# Altium schematic sheet MCU.SchDoc
size 420 x 297 mm; SheetNumber: 1; Scale: {Мш.}; PageSetup: Record=PageOptions|CenterHorizontal=False|CenterVertical=False|PrintScale=0.49|XCorrection=0.00|YCorrection=0.00|PrintKind=1|BorderSize=5000000|LeftOffset=0|BottomOffset=0|Orientation=1|PaperLength=1000|PaperWidth=1000|Scale=100|PaperSource=15|PrintQuality=600|MediaType=1|DitherType=10|PrintScaleMode=1|PaperKind=A4; ProcessInspection: {Т.контр.}; Mass: {М.}; NormInspection: {Н.контр.}; Letter1Column: {}; Letter2Column: {}; Letter3Column: {}; DocumentType: {Документ}
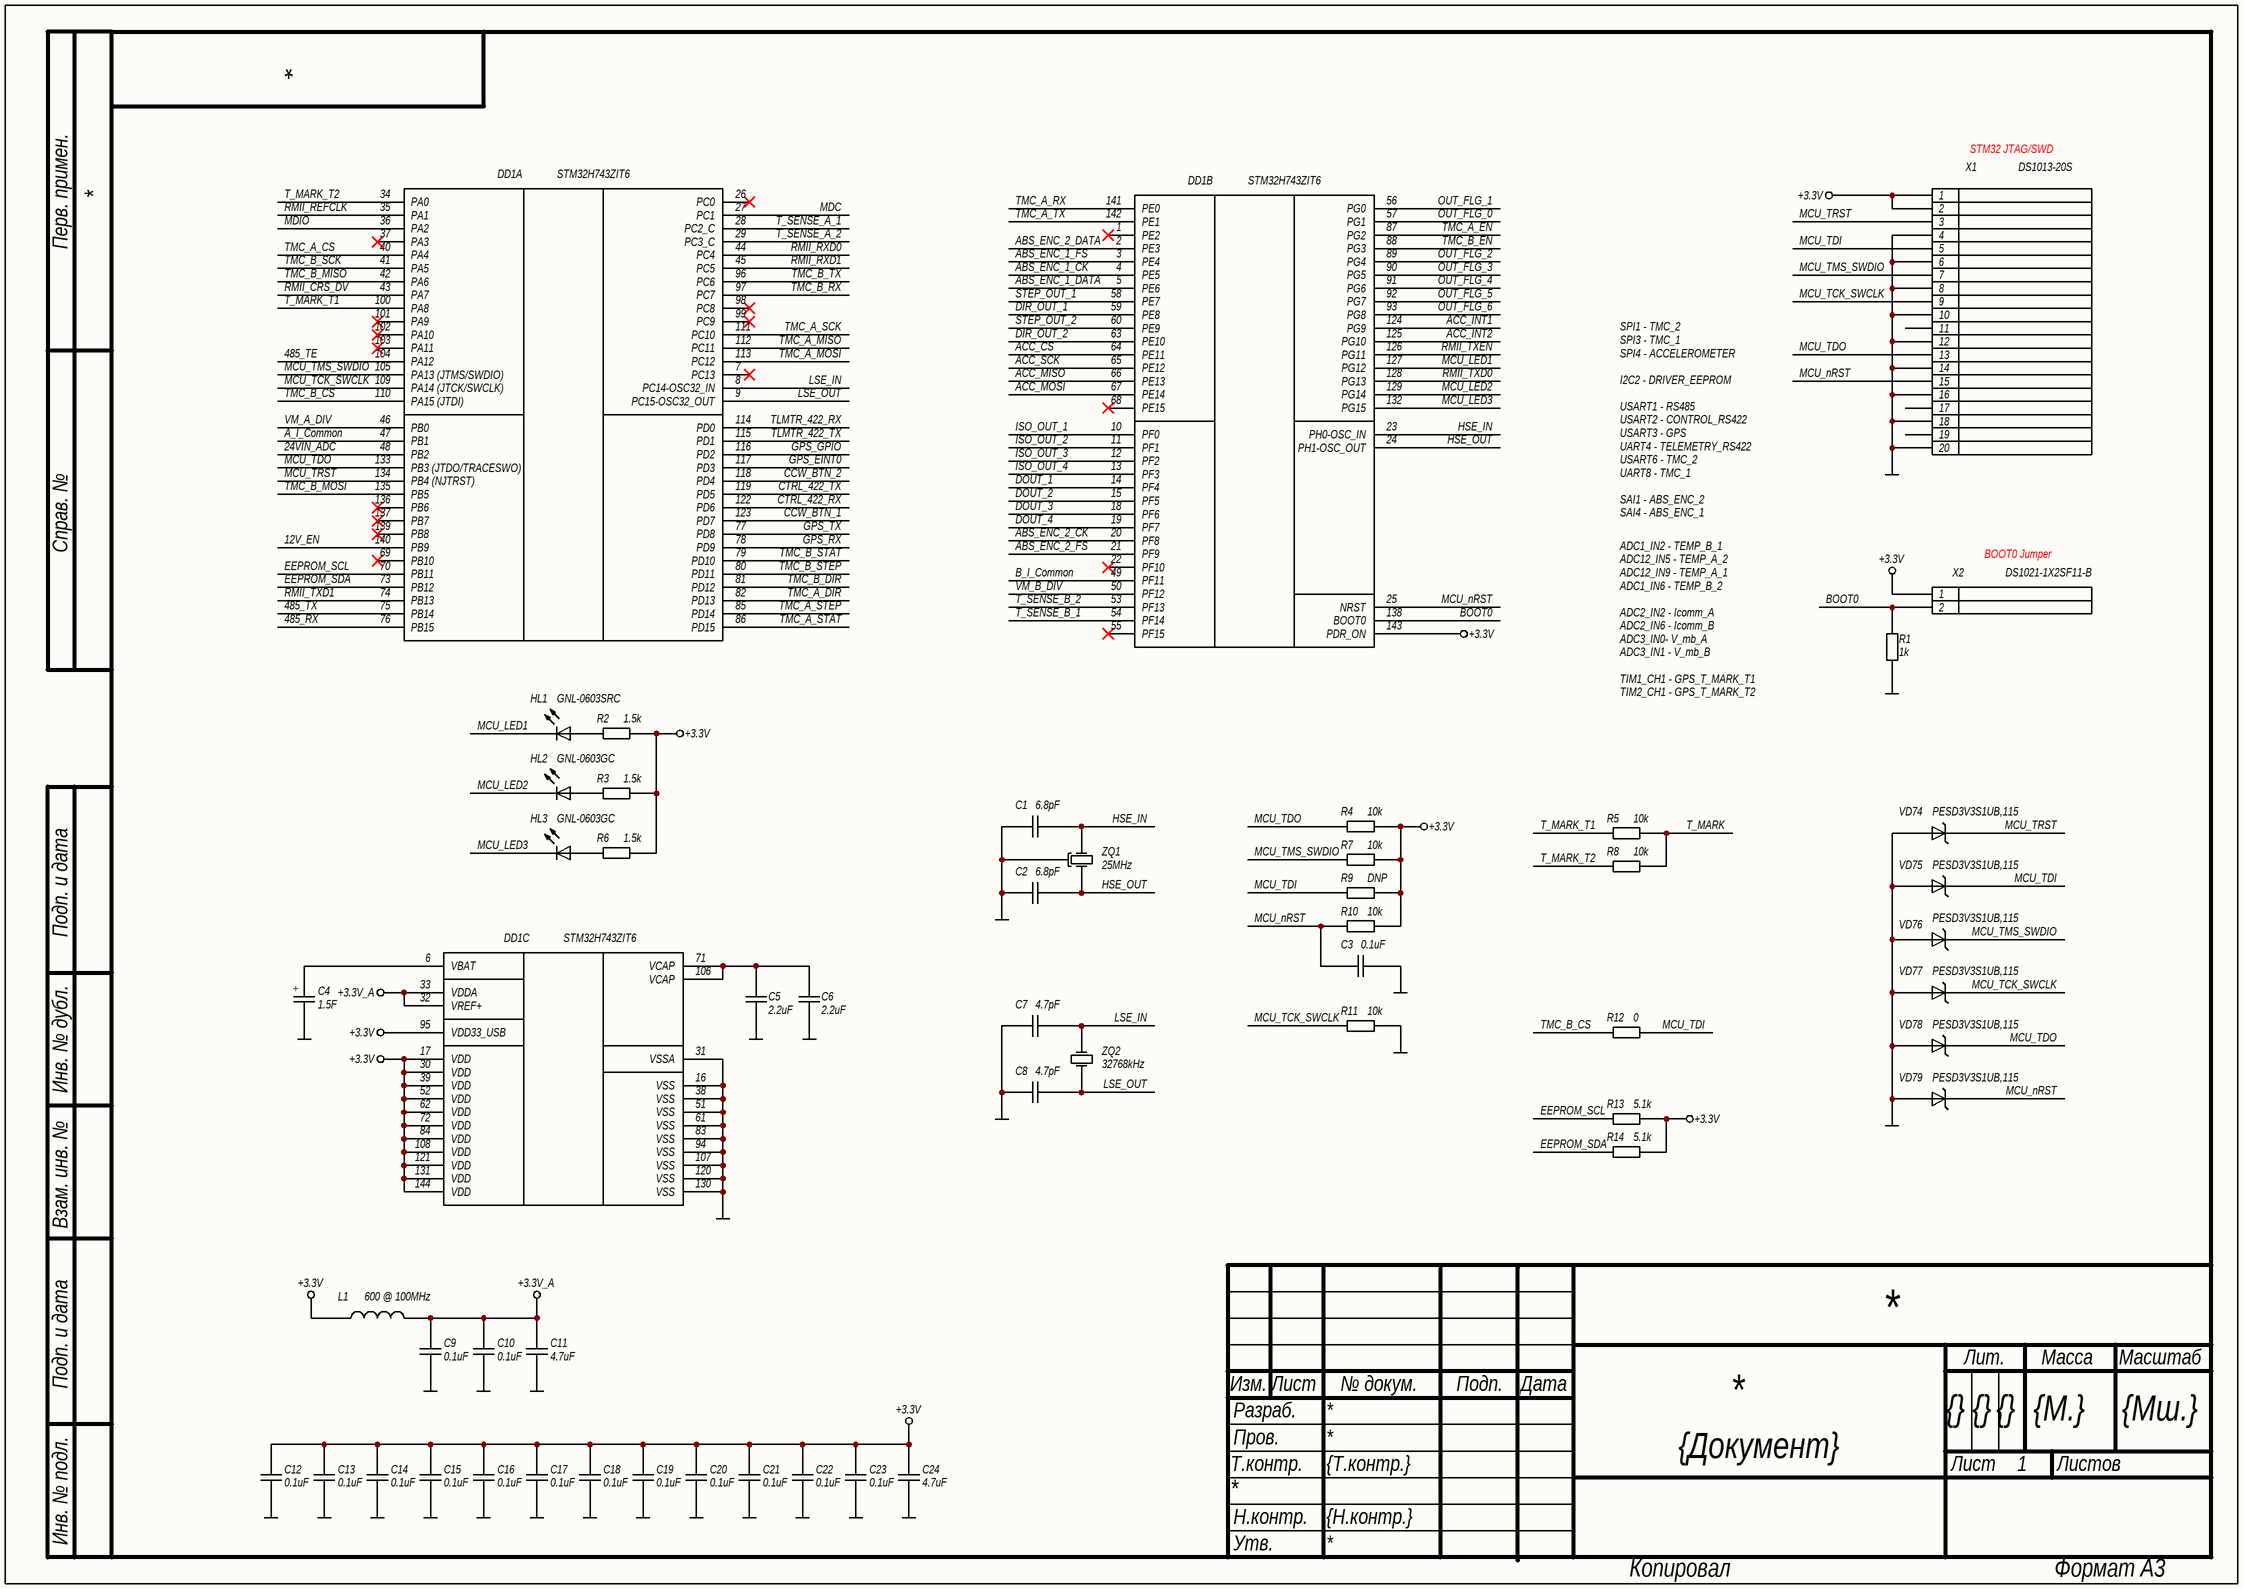
[diagram p0: MCU.SchDoc]

## Parts
C1  6.8pF  [C0603N]
C2  6.8pF  [C0603N]
C3  0.1uF  [C0603N]
C4  1.5F  [KR-5R5H155-R]
C5  2.2uF  [C0603N]
C6  2.2uF  [C0603N]
C7  4.7pF  [C0603N]
C8  4.7pF  [C0603N]
C9  0.1uF  [C0603N]
C10  0.1uF  [C0603N]
C11  4.7uF  [C0603N]
C12  0.1uF  [C0603N]
C13  0.1uF  [C0603N]
C14  0.1uF  [C0603N]
C15  0.1uF  [C0603N]
C16  0.1uF  [C0603N]
C17  0.1uF  [C0603N]
C18  0.1uF  [C0603N]
C19  0.1uF  [C0603N]
C20  0.1uF  [C0603N]
C21  0.1uF  [C0603N]
C22  0.1uF  [C0603N]
C23  0.1uF  [C0603N]
C24  4.7uF  [C0603N]
DD1  STM32H743ZIT6  [LQFP144]  (parts A,B,C of 3)
HL1  GNL-0603SRC  [LED0603]
HL2  GNL-0603GC  [LED0603]
HL3  GNL-0603GC  [LED0603]
L1  600 @ 100MHz  [FB0603N]
R1  1k  [R0603N]
R2  1.5k  [R0603N]
R3  1.5k  [R0603N]
R4  10k  [R0603N]
R5  10k  [R0603N]
R6  1.5k  [R0603N]
R7  10k  [R0603N]
R8  10k  [R0603N]
R9  DNP  [R0603N]  (no BOM)
R10  10k  [R0603N]
R11  10k  [R0603N]
R12  0  [R0603N]
R13  5.1k  [R0603N]
R14  5.1k  [R0603N]
VD74  PESD3V3S1UB,115  [SOD523]
VD75  PESD3V3S1UB,115  [SOD523]
VD76  PESD3V3S1UB,115  [SOD523]
VD77  PESD3V3S1UB,115  [SOD523]
VD78  PESD3V3S1UB,115  [SOD523]
VD79  PESD3V3S1UB,115  [SOD523]
X1  DS1013-20S  [2.54_2X10_HEADER_BOX]
X2  DS1021-1X2SF11-B  [2.54_2X1_HEADER]
ZQ1  25MHz  [NX3225GA]
ZQ2  32768kHz  [NX3215SA]

## Nets
+3.3V: C12.2 C13.2 C14.2 C15.2 C16.2 C17.2 C18.2 C19.2 C20.2 C21.2 C22.2 C23.2 C24.2 DD1.17(VDD) DD1.30(VDD) DD1.39(VDD) DD1.52(VDD) DD1.62(VDD) DD1.72(VDD) DD1.84(VDD) DD1.95(VDD33_USB) DD1.108(VDD) DD1.121(VDD) DD1.131(VDD) DD1.143(PDR_ON) DD1.144(VDD) L1.1 R2.1 R3.1 R4.1 R6.1 R7.1 R9.1 R10.1 R13.1 R14.1 X1.1 X1.2 X2.1
+3.3V_A: C9.2 C10.2 C11.2 DD1.32(VREF+) DD1.33(VDDA) L1.2
GND: C1.2 C2.2 C3.1 C4.2 C5.1 C6.1 C7.2 C8.2 C9.1 C10.1 C11.1 C12.1 C13.1 C14.1 C15.1 C16.1 C17.1 C18.1 C19.1 C20.1 C21.1 C22.1 C23.1 C24.1 DD1.16(VSS) DD1.31(VSSA) DD1.38(VSS) DD1.51(VSS) DD1.61(VSS) DD1.83(VSS) DD1.94(VSS) DD1.107(VSS) DD1.120(VSS) DD1.130(VSS) R1.2 R11.2 VD74.2(A) VD75.2(A) VD76.2(A) VD77.2(A) VD78.2(A) VD79.2(A) X1.4 X1.6 X1.8 X1.10 X1.12 X1.14 X1.16 X1.18 X1.20 ZQ1.2
12V_EN: DD1.140(PB9)
24VIN_ADC: DD1.48(PB2)
485_RX: DD1.76(PB15)
485_TE: DD1.104(PA12)
485_TX: DD1.75(PB14)
A_I_Common: DD1.47(PB1)
ABS_ENC_1_CK: DD1.4(PE5)
ABS_ENC_1_DATA: DD1.5(PE6)
ABS_ENC_1_FS: DD1.3(PE4)
ABS_ENC_2_CK: DD1.20(PF8)
ABS_ENC_2_DATA: DD1.2(PE3)
ABS_ENC_2_FS: DD1.21(PF9)
ACC_CS: DD1.64(PE11)
ACC_INT1: DD1.124(PG9)
ACC_INT2: DD1.125(PG10)
ACC_MISO: DD1.66(PE13)
ACC_MOSI: DD1.67(PE14)
ACC_SCK: DD1.65(PE12)
B_I_Common: DD1.49(PF11)
BOOT0: DD1.138(BOOT0) R1.1 X2.2
CCW_BTN_1: DD1.123(PD7)
CCW_BTN_2: DD1.118(PD4)
CTRL_422_RX: DD1.122(PD6)
CTRL_422_TX: DD1.119(PD5)
DIR_OUT_1: DD1.59(PE8)
DIR_OUT_2: DD1.63(PE10)
DOUT_1: DD1.14(PF4)
DOUT_2: DD1.15(PF5)
DOUT_3: DD1.18(PF6)
DOUT_4: DD1.19(PF7)
EEPROM_SCL: DD1.70(PB11) R13.2
EEPROM_SDA: DD1.73(PB12) R14.2
GPS_EINT0: DD1.117(PD3)
GPS_GPIO: DD1.116(PD2)
GPS_RX: DD1.78(PD9)
GPS_TX: DD1.77(PD8)
HSE_IN: C1.1 DD1.23(PH0-OSC_IN) ZQ1.1
HSE_OUT: C2.1 DD1.24(PH1-OSC_OUT) ZQ1.3
ISO_OUT_1: DD1.10(PF0)
ISO_OUT_2: DD1.11(PF1)
ISO_OUT_3: DD1.12(PF2)
ISO_OUT_4: DD1.13(PF3)
LSE_IN: C7.1 DD1.8(PC14-OSC32_IN) ZQ2.2
LSE_OUT: C8.1 DD1.9(PC15-OSC32_OUT) ZQ2.1
MCU_LED1: DD1.127(PG12) HL1.1(K)
MCU_LED2: DD1.129(PG14) HL2.1(K)
MCU_LED3: DD1.132(PG15) HL3.1(K)
MCU_nRST: C3.2 DD1.25(NRST) R10.2 VD79.1(K) X1.15
MCU_TCK_SWCLK: DD1.109(PA14_(JTCK/SWCLK)) R11.1 VD77.1(K) X1.9
MCU_TDI: R9.2 R12.1 VD75.1(K) X1.5
MCU_TDO: DD1.133(PB3_(JTDO/TRACESWO)) R4.2 VD78.1(K) X1.13
MCU_TMS_SWDIO: DD1.105(PA13_(JTMS/SWDIO)) R7.2 VD76.1(K) X1.7
MCU_TRST: DD1.134(PB4_(NJTRST)) VD74.1(K) X1.3
MDC: DD1.27(PC1)
MDIO: DD1.36(PA2)
OUT_FLG_0: DD1.57(PG1)
OUT_FLG_1: DD1.56(PG0)
OUT_FLG_2: DD1.89(PG4)
OUT_FLG_3: DD1.90(PG5)
OUT_FLG_4: DD1.91(PG6)
OUT_FLG_5: DD1.92(PG7)
OUT_FLG_6: DD1.93(PG8)
RMII_CRS_DV: DD1.43(PA7)
RMII_REFCLK: DD1.35(PA1)
RMII_RXD0: DD1.44(PC4)
RMII_RXD1: DD1.45(PC5)
RMII_TXD0: DD1.128(PG13)
RMII_TXD1: DD1.74(PB13)
RMII_TXEN: DD1.126(PG11)
STEP_OUT_1: DD1.58(PE7)
STEP_OUT_2: DD1.60(PE9)
T_MARK: R5.2 R8.2
T_MARK_T1: DD1.100(PA8) R5.1
T_MARK_T2: DD1.34(PA0) R8.1
T_SENSE_A_1: DD1.28(PC2_C)
T_SENSE_A_2: DD1.29(PC3_C)
T_SENSE_B_1: DD1.54(PF14)
T_SENSE_B_2: DD1.53(PF13)
TLMTR_422_RX: DD1.114(PD0)
TLMTR_422_TX: DD1.115(PD1)
TMC_A_CS: DD1.40(PA4)
TMC_A_DIR: DD1.82(PD13)
TMC_A_EN: DD1.87(PG2)
TMC_A_MISO: DD1.112(PC11)
TMC_A_MOSI: DD1.113(PC12)
TMC_A_RX: DD1.141(PE0)
TMC_A_SCK: DD1.111(PC10)
TMC_A_STAT: DD1.86(PD15)
TMC_A_STEP: DD1.85(PD14)
TMC_A_TX: DD1.142(PE1)
TMC_B_CS: DD1.110(PA15_(JTDI)) R12.2
TMC_B_DIR: DD1.81(PD12)
TMC_B_EN: DD1.88(PG3)
TMC_B_MISO: DD1.42(PA6)
TMC_B_MOSI: DD1.135(PB5)
TMC_B_RX: DD1.97(PC7)
TMC_B_SCK: DD1.41(PA5)
TMC_B_STAT: DD1.79(PD10)
TMC_B_STEP: DD1.80(PD11)
TMC_B_TX: DD1.96(PC6)
VM_A_DIV: DD1.46(PB0)
VM_B_DIV: DD1.50(PF12)
NetC4_1: C4.1 DD1.6(VBAT)
NetC5_2: C5.2 C6.2 DD1.71(VCAP) DD1.106(VCAP)
NetHL1_2: HL1.2(A) R2.2
NetHL2_2: HL2.2(A) R3.2
NetHL3_2: HL3.2(A) R6.2

Not connected (* = marked no-connect by the designer): DD1 1(PE2)* 7(PC13)* 22(PF10)* 26(PC0)* 37(PA3)* 55(PF15)* 68(PE15)* 69(PB10)* 98(PC8)* 99(PC9)* 101(PA9)* 102(PA10)* 103(PA11)* 136(PB6)* 137(PB7)* 139(PB8)*; X1 11 17 19

## Notes on the sheet
- STM32 JTAG/SWD
- SPI1 - TMC_2
- SPI3 - TMC_1
- I2C2 - DRIVER_EEPROM
- SPI4 - ACCELEROMETER
- USART2 - CONTROL_RS422
- USART6 - TMC_2
- USART1 - RS485
- USART3 - GPS
- UART4 - TELEMETRY_RS422
- UART8 - TMC_1
- SAI1 - ABS_ENC_2
- SAI4 - ABS_ENC_1
- ADC1_IN2 - TEMP_B_1
- ADC12_IN5 - TEMP_A_2
- ADC12_IN9 - TEMP_A_1
- ADC1_IN6 - TEMP_B_2
- BOOT0 Jumper
- ADC2_IN2 - Icomm_A
- ADC2_IN6 - Icomm_B
- ADC3_IN0- V_mb_A
- ADC3_IN1 - V_mb_B
- TIM1_CH1 - GPS_T_MARK_T1
- TIM2_CH1 - GPS_T_MARK_T2
- Перв. примен.
- Справ. №
- Подп. и дата
- Инв. № дубл.
- Взам. инв. №
- Изм.
- Лист
- № докум.
- Подп.
- Дата
- Лит.
- Масса
- Масштаб
- Т.контр.
- Пров.
- Разраб.
- Листов
- Инв. № подл.
- Н.контр.
- Утв.
- Копировал
- Формат А3
- (in symbol KR-5R5H155-R) +

## Library data of the parts
C1 C2 = CC0603CRNPO9BN6R8: Конденсатор; Точность: ±0.25pF; Напряжение: 50V; Диэлектрик: NP0; Производитель: YAGEO; Описание: 6.8 pF ±0.25pF 50V Ceramic Capacitor C0G, NP0 0603 (1608 Metric); Корпус: 0603 (1608 Metric); Температурный диапазон: -55°C ~ 125°C; Вид монтажа: SMD; Артикул: CC0603CRNPO9BN6R8; Номинал: 6.8pF; Строка для документации: https://www.yageo.com/upload/media/product/productsearch/datasheet/mlcc/UPY-GP_NP0_16V-to-50V_18.pdf; Тип элемента: Конденсатор
C3 C9 C10 C12-C23 = CL10B104KB8NNNC: Конденсатор; Точность: 10%; Напряжение: 50V; Диэлектрик: X7R; Производитель: Samsung Electro-Mechanics; Описание: 0.1 µF ±10% 50V Ceramic Capacitor X7R 0603 (1608 Metric); Корпус: 0603 (1608 Metric); Температурный диапазон: -55°C ~ 125°C; Вид монтажа: SMD; Артикул: CL10B104KB8NNNC; Номинал: 0.1uF; Строка для документации: https://mm.digikey.com/Volume0/opasdata/d220001/medias/docus/609/CL10B104KB8NNNC_Spec.pdf; Тип элемента: Конденсатор
C4 = KR-5R5H155-R: Ионистор; Точность: -20%, +80%; Напряжение: 5.5V; Диэлектрик: EDLC; Производитель: Eaton - Electronics Division; Описание: 1.5 F (EDLC) Supercapacitor 5.5 V Axial, Can - Horizontal 30Ohm @ 1kHz 1000 Hrs @ 70°C; Корпус: 19.00mm dia x 6.5mm; Температурный диапазон: -25°C ~ 70°C; Вид монтажа: Through Hole; Тип элемента: Конденсатор; Артикул: KR-5R5H155-R; Номинал: 1.5F; Строка для документации: https://www.eaton.com/content/dam/eaton/products/electronic-components/resources/data-sheet/eaton-kr-supercapacitors-coin-cells-data-sheet.pdf
C5 C6 = CL10A225KO8NNNC: Конденсатор; Точность: 10%; Напряжение: 16V; Диэлектрик: X5R; Производитель: Samsung Electro-Mechanics; Описание: 2.2 µF ±10% 16V Ceramic Capacitor X5R 0603 (1608 Metric); Корпус: 0603 (1608 Metric); Температурный диапазон: -55°C ~ 85°C; Вид монтажа: SMD; Артикул: CL10A225KO8NNNC; Номинал: 2.2uF; Строка для документации: https://mm.digikey.com/Volume0/opasdata/d220001/medias/docus/421/CL10A225KO8NNNC_Spec.pdf; Тип элемента: Конденсатор
C7 C8 = CC0603CRNPO9BN4R7: Конденсатор; Точность: ±0.25pF; Напряжение: 50V; Диэлектрик: NP0; Производитель: YAGEO; Описание: 4.7 pF ±0.25pF 50V Ceramic Capacitor C0G, NP0 0603 (1608 Metric); Корпус: 0603 (1608 Metric); Температурный диапазон: -55°C ~ 125°C; Вид монтажа: SMD; Артикул: CC0603CRNPO9BN4R7; Номинал: 4.7pF; Строка для документации: https://www.yageo.com/upload/media/product/productsearch/datasheet/mlcc/UPY-GP_NP0_16V-to-50V_18.pdf; Тип элемента: Конденсатор
C11 C24 = CL10A475KO8NNNC: Конденсатор; Точность: 10%; Напряжение: 16V; Диэлектрик: X5R; Производитель: Samsung Electro-Mechanics; Описание: 4.7 µF ±10% 16V Ceramic Capacitor X5R 0603 (1608 Metric); Корпус: 0603 (1608 Metric); Температурный диапазон: -55°C ~ 85°C; Вид монтажа: SMD; Артикул: CL10A475KO8NNNC; Номинал: 4.7uF; Строка для документации: https://mm.digikey.com/Volume0/opasdata/d220001/medias/docus/2328/CL10A475KO8NNNC_Spec.pdf; Тип элемента: Конденсатор
DD1 = STM32H743ZIT6: Микросхема микроконтроллер; Производитель: STMicroelectronics; Описание: ARM® Cortex®-M7 STM32H7 Microcontroller IC 32-Bit Single-Core 480MHz 2MB (2M x 8) FLASH 144-LQFP (20x20); Корпус: 144-LQFP (20x20); Температурный диапазон: -40°C ~ 85°C (TA); Вид монтажа: SMD; Артикул: STM32H743ZIT6; Строка для документации: https://www.st.com/resource/en/datasheet/stm32h743bi.pdf; Тип элемента: Микросхема
HL1 = GNL-0603SRC: Светодиод; Прямой ток: 20mA; Напряжение: 2V; Яркость: 15mcd; Цвет: Зеленый; Длина волны: 660nm; Производитель: G-nor Electronics; Описание: Green 567nm LED Indication - Discrete 2V 0603 (1608 Metric); Корпус: 0603 (1608 Metric); Температурный диапазон: -40°C ~ 80°C; Вид монтажа: SMD; Тип элемента: Диод светоизлучающий; Артикул: GNL-0603SRC; Строка для документации: https://www.g-nor.com/Uploads/Ed/file/20210517/1621223120713818.doc
HL2 HL3 = GNL-0603GC: Светодиод; Прямой ток: 20mA; Напряжение: 2V; Яркость: 12mcd; Цвет: Зеленый; Длина волны: 567nm; Производитель: G-nor Electronics; Описание: Green 567nm LED Indication - Discrete 2V 0603 (1608 Metric); Корпус: 0603 (1608 Metric); Температурный диапазон: -40°C ~ 80°C; Вид монтажа: SMD; Тип элемента: Диод светоизлучающий; Артикул: GNL-0603GC; Строка для документации: https://www.g-nor.com/Uploads/Ed/file/20210517/1621223120713818.doc
L1 = BLM18AG601SN1D: Фильтр ЭМП индуктивный; Ток: 500mA; Сопротивление: 380m; Тип: Ferrite Bead; Производитель: Murata Electronics; Описание: 600 Ohms @ 100 MHz 1 Ferrite Bead 0603 (1608 Metric) 500mA 380mOhm; Корпус: 0603 (1608 Metric); Температурный диапазон: -55°C ~ 125°C; Вид монтажа: SMD; Артикул: BLM18AG601SN1D; Номинал: 600 @ 100MHz; Строка для документации: https://www.murata.com/en-us/products/productdata/8796738650142/ENFA0003.pdf; Тип элемента: Фильтр ЭМП
R1 = RC0603FR-071KL: Резистор; Точность: 1%; ТКС: ±100ppm/°C; Напряжение: 75V; Производитель: YAGEO; Описание: 1 kOhms ±1% 0.1W, 1/10W Chip Resistor 0603 (1608 Metric) Moisture Resistant Thick Film; Корпус: 0603 (1608 Metric); Температурный диапазон: -55°C ~ 155°C; Вид монтажа: SMD; Артикул: RC0603FR-071KL; Номинал: 1k; Строка для документации: https://www.yageo.com/upload/media/product/app/datasheet/rchip/pyu-rc_group_51_rohs_l.pdf; Тип элемента: Резистор
R2 R3 R6 = RC0603FR-071K5L: Резистор; Точность: 1%; ТКС: ±100ppm/°C; Напряжение: 75V; Производитель: YAGEO; Описание: 1.5 kOhms ±1% 0.1W, 1/10W Chip Resistor 0603 (1608 Metric) Moisture Resistant Thick Film; Корпус: 0603 (1608 Metric); Температурный диапазон: -55°C ~ 155°C; Вид монтажа: SMD; Артикул: RC0603FR-071K5L; Номинал: 1.5k; Строка для документации: https://www.yageo.com/upload/media/product/app/datasheet/rchip/pyu-rc_group_51_rohs_l.pdf; Тип элемента: Резистор
R4 R5 R7-R11 = RC0603FR-0710KL: Резистор; Точность: 1%; ТКС: ±100ppm/°C; Напряжение: 75V; Производитель: YAGEO; Описание: 10 kOhms ±1% 0.1W, 1/10W Chip Resistor 0603 (1608 Metric) Moisture Resistant Thick Film; Корпус: 0603 (1608 Metric); Температурный диапазон: -55°C ~ 155°C; Вид монтажа: SMD; Артикул: RC0603FR-0710KL; Строка для документации: https://www.yageo.com/upload/media/product/app/datasheet/rchip/pyu-rc_group_51_rohs_l.pdf; Тип элемента: Резистор
  R4 R5 R7 R8 R10 R11: Номинал: 10k
  R9: Номинал: DNP
R12 = RC0603FR-070RL: Резистор; Точность: 1%; Напряжение: 75V; Производитель: YAGEO; Описание: 0 Ohms Jumper Chip Resistor 0603 (1608 Metric) Moisture Resistant Thick Film; Корпус: 0603 (1608 Metric); Температурный диапазон: -55°C ~ 155°C; Вид монтажа: SMD; Артикул: RC0603FR-070RL; Номинал: 0; Строка для документации: https://www.yageo.com/upload/media/product/app/datasheet/rchip/pyu-rc_group_51_rohs_l.pdf; Тип элемента: Резистор
R13 R14 = RC0603FR-075K1L: Резистор; Точность: 1%; ТКС: ±100ppm/°C; Напряжение: 75V; Производитель: YAGEO; Описание: 5.1 kOhms ±1% 0.1W, 1/10W Chip Resistor 0603 (1608 Metric) Moisture Resistant Thick Film; Корпус: 0603 (1608 Metric); Температурный диапазон: -55°C ~ 155°C; Вид монтажа: SMD; Артикул: RC0603FR-075K1L; Номинал: 5.1k; Строка для документации: https://www.yageo.com/upload/media/product/app/datasheet/rchip/pyu-rc_group_51_rohs_l.pdf; Тип элемента: Резистор
VD74-VD79 = PESD3V3S1UB,115: TVS диод однонаправлвенный; Напряжение: 5V; Напряжение ограничения: 20V; Напряжение пробоя: 5.2V; Ток: 18A; Тип: TVS Unidirectional; Производитель: Nexperia USA Inc.; Описание: 20V Clamp 18A (8/20µs) Ipp Tvs Diode Surface Mount SOD-523; Корпус: SC-79, SOD-523; Температурный диапазон: -65°C ~ 150°C (TA); Вид монтажа: SMD; Тип элемента: Диод защитный; Артикул: PESD3V3S1UB,115; Строка для документации: https://assets.nexperia.com/documents/data-sheet/PESD3V3S1UB.pdf
X1 = DS1013-20S: Разъем, 20 контактов; Тип разъема: Header, Male Pin; Количество контактов: 20; Шаг контактов: 2.54mm; Ток: 3A; Напряжение: 250V; Производитель: Connfly electronic (Zhenqin); Описание: Connector Header Through Hole 30 position 0.100" (2.54mm); Температурный диапазон: -40°C ~ 105°C; Вид монтажа: Through Hole; Артикул: DS1013-20S; Строка для документации: http://cn.connfly.group/static/upload/file/pdf/DS1013.pdf; Тип элемента: Разъем
X2 = DS1021-1X2SF11-B: Разъем, 2 контакта; Тип разъема: Header, Male Pin; Количество контактов: 2; Шаг контактов: 2.54mm; Ток: 3A; Напряжение: 250V; Производитель: Connfly electronic (Zhenqin); Описание: Connector Header Through Hole 2 position 0.100" (2.54mm); Температурный диапазон: -40°C ~ 105°C; Вид монтажа: Through Hole; Артикул: DS1021-1X2SF11-B; Строка для документации: http://cn.connfly.group/static/upload/file/pdf/DS1021.pdf; Тип элемента: Разъем
ZQ1 = NX3225GA-25.000M: Кварцевый резонатор, экранированный; Точность: ±20ppm; Описание: 25 MHz ±20ppm Crystal 8pF 50 Ohms 4-SMD, No Lead; Тип: MHz Crystal; Производитель: NDK America, Inc.; Температурный диапазон: -40°C ~ 85°C; Корпус: 3.20mm x 2.50mm; Вид монтажа: SMD; Артикул: NX3225GA-25.000M; Частота: 25MHz; Строка для документации: https://www.ndk.com/en/products/upload/lineup/pdf/NDKX03-00006_en.pdf; Тип элемента: Кварцевый резонатор
ZQ2 = NX3215SA-32.768K: Кварцевый резонатор; Точность: ±20ppm; Описание: 32.768 kHz ±20ppm Crystal 7pF 70 kOhms 2-SMD, No Lead; Тип: kHz Crystal (Tuning Fork); Производитель: NDK America, Inc.; Температурный диапазон: -40°C ~ 85°C; Корпус: 3.20mm x 1.50mm; Вид монтажа: SMD; Артикул: NX3215SA-32.768K; Частота: 32768kHz; Строка для документации: https://www.ndk.com/images/products/catalog/c_NX3215SA_e.pdf; Тип элемента: Кварцевый резонатор